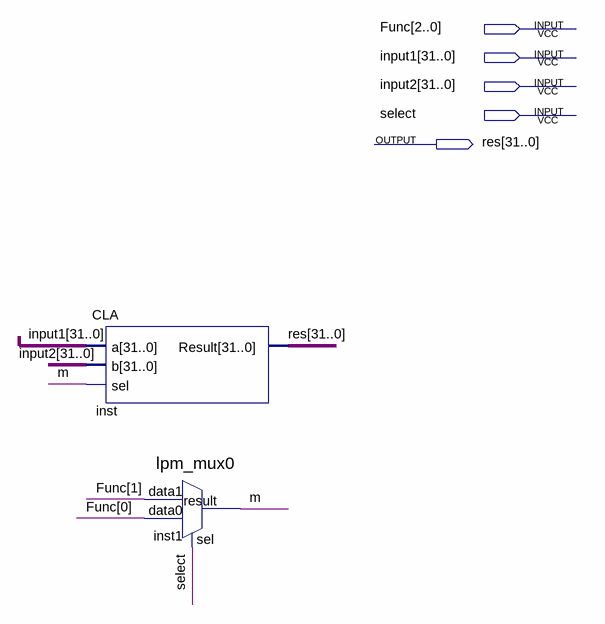
[diagram p0: schematic sheet]
// Quartus schematic ALU.bdf as structural Verilog: 2 symbols, 5 pins
module ALU (
  input  [2:0] Func,
  input  [31:0] input1,
  input  [31:0] input2,
  input  select,
  output [31:0] res
);

  wire m;

  CLA inst (.a(input1), .b(input2), .sel(m), .Result(res));
  lpm_mux0 inst1 (.data1(Func[1]), .data0(Func[0]), .sel(select), .result(m));
endmodule
